# EAGLE design Adapter V8 (EAGLE 9.1.0)
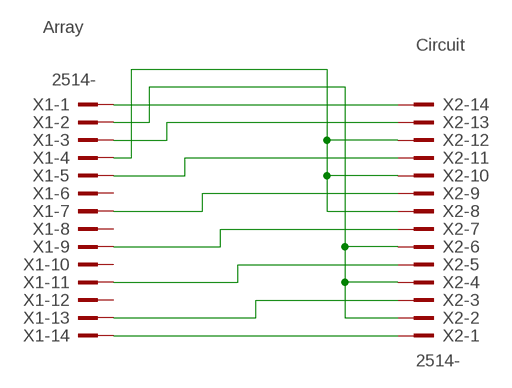
[diagram p0: schematic, sheet 1]

## Parts
X1  2514-  [PAK100/2500-14]
X2  2514-  [PAK100/2500-14]

## Nets
N$1: X1.1 X2.14
N$2: X1.3 X2.13
N$3: X1.5 X2.11
N$4: X1.7 X2.9
N$5: X1.9 X2.7
N$6: X1.11 X2.5
N$7: X1.13 X2.3
N$8: X1.14 X2.1
N$9: X1.2 X2.2 X2.4 X2.6
N$10: X1.4 X2.8 X2.10 X2.12
Unconnected: X1.6 X1.8 X1.10 X1.12

## Notes on the sheet
- Array
- Circuit

## Library data of the parts
X1 X2 = con-3m:2514-: 3M (TM) Pak 100 4-Wall Header Source: 3M; OC_FARNELL: unknown; OC_NEWARK: unknown

## Board
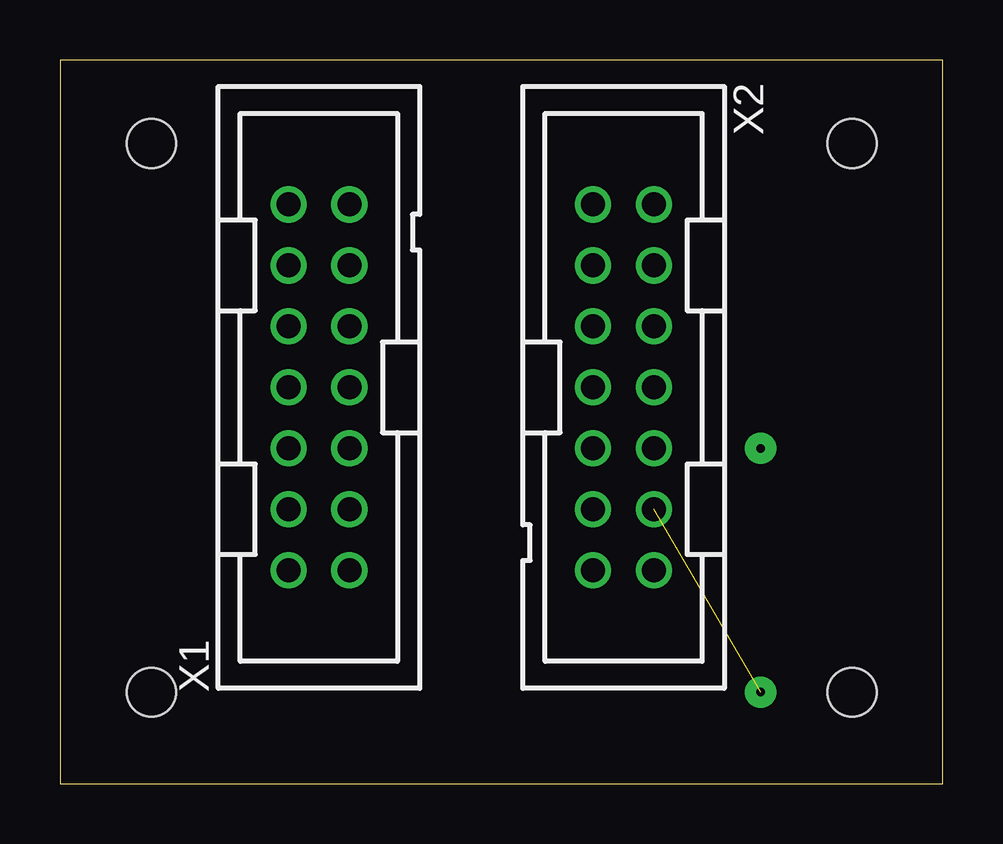
[diagram p1: board, top side]
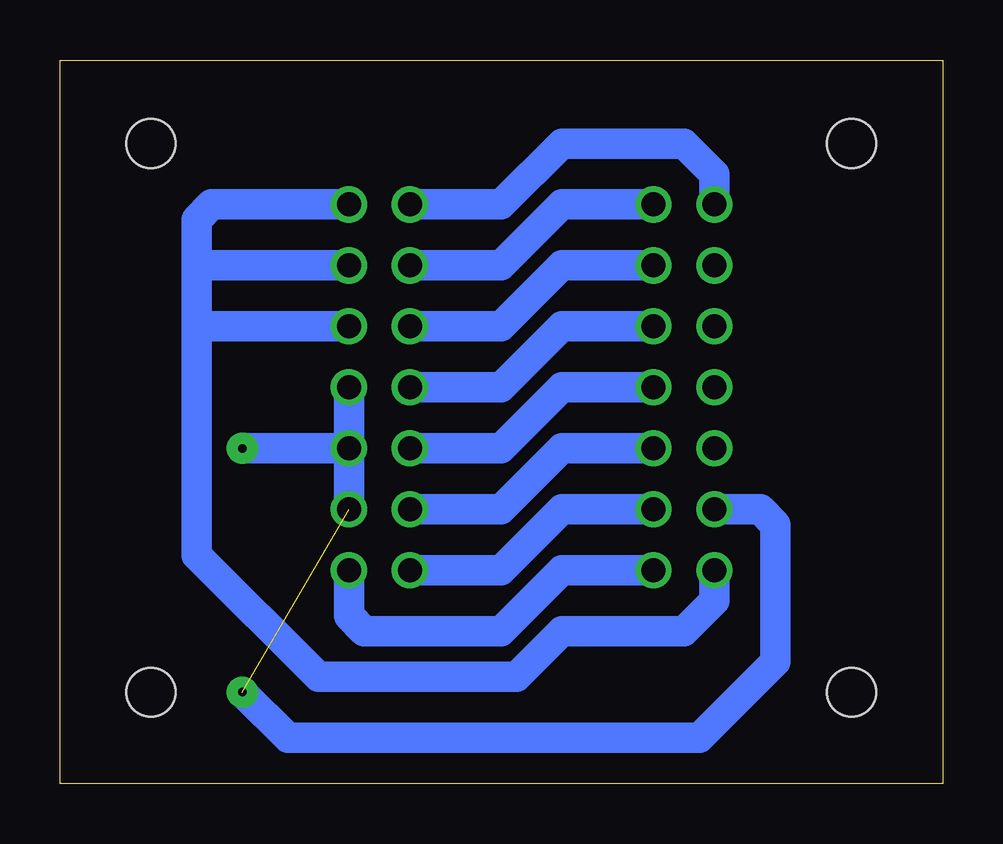
[diagram p2: board, bottom side, seen from below]

Size 36.81 x 30.15 mm. Coordinates in mm from the lower left corner, seen from the top.
Outline: 0,0 36.81,0 36.81,30.15 0,30.15 0,0
Copper layers (1*16): Top 0.035mm / dielectric 1.5mm / Bottom 0.035mm
Design rules "default": minimum track width 6mil, minimum drill 0.35mm, track to track 6mil, track to pad 6mil, pad to pad 6mil, via to via 6mil, smd to smd 6mil, copper to edge 40mil, drill to drill 6mil, minimum pad ring 10mil, minimum via ring 8mil, stop-mask expansion 4mil, vias tented up to drill 0mil, thermal gap 10mil
Holes 2.03 mm at 3.81,3.81 3.81,26.67 33.02,26.67 33.02,3.81

### Footprints (pad centres in the part's own frame; a part is rotated, then mirrored left to right if it is on the bottom)
PAK100/2500-14 = drill 1 pad 1.422: 1 -7.62,-1.27; 2 -7.62,1.27; 3 -5.08,-1.27; 4 -5.08,1.27; 5 -2.54,-1.27; 6 -2.54,1.27; 7 0,-1.27; 8 0,1.27; 9 2.54,-1.27; 10 2.54,1.27; 11 5.08,-1.27; 12 5.08,1.27; 13 7.62,-1.27; 14 7.62,1.27

### Placement (x,y rotation side)
X1  10.79,16.51 90 top
X2  23.5,16.51 270 top

### Tracks (layer width: path | path; a pad name or v marks a point on that pad's centre or on a via)
N$1
  Bottom 1.27: X1.1 15.88,8.89 18.41,6.35 24.13,6.35 24.77,6.99 X2.14
N$2
  Bottom 1.27: X1.3 15.88,11.43 18.41,8.89 X2.13
N$3
  Bottom 1.27: X1.5 15.88,13.97 18.41,11.43 X2.11
N$4
  Bottom 1.27: X1.7 15.88,16.51 18.41,13.97 X2.9
N$5
  Bottom 1.27: X1.9 15.88,19.05 18.41,16.51 X2.7
N$6
  Bottom 1.27: X1.11 15.88,21.59 18.41,19.05 X2.5
N$7
  Bottom 1.27: X1.13 15.88,24.13 18.41,21.59 X2.3
N$8
  Bottom 1.27: X1.14 9.53,25.4 10.79,26.67 15.88,26.67 18.41,24.13 X2.1
N$9
  Bottom 1.27: X1.2 9.53,7.62 10.79,6.35 15.88,6.35 17.78,4.45 26.04,4.45 31.11,9.53 31.11,19.05 | 31.11,21.59 31.11,23.5 30.48,24.13 X2.2 | X2.4 31.11,21.59 | 31.11,19.05 28.57,19.05 X2.6 | 31.11,19.05 31.11,21.59
N$10  (via drill 0.35 pad 1.3)  (1 unrouted)
  Bottom 1.27: X2.8 X2.10 | X2.10 X2.12 | X2.10 v29.21,13.97 | X1.4 7.62,11.43 6.99,10.79 6.99,5.08 10.16,1.91 27.3,1.91 v29.21,3.81